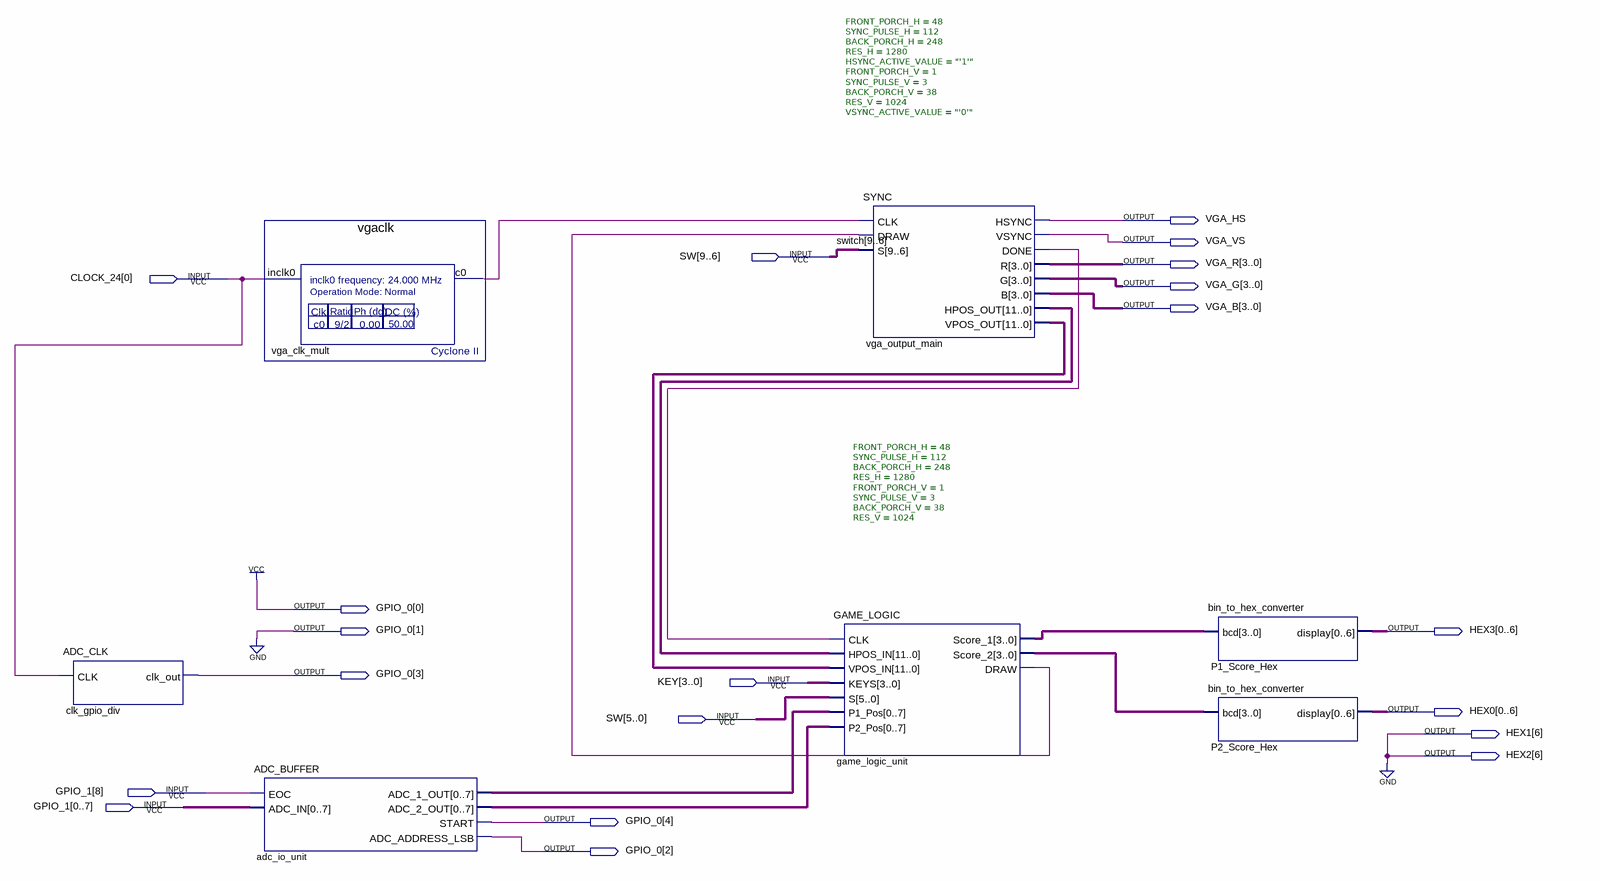
[diagram p0: schematic sheet]
// Quartus schematic VGA_Pong.bdf as structural Verilog: 7 symbols, 20 pins
module VGA_Pong (
  input  [9:0] SW,
  input  [0:0] CLOCK_24,
  input  [3:0] KEY,
  input  [0:8] GPIO_1,
  output VGA_HS,
  output VGA_VS,
  output [3:0] VGA_R,
  output [3:0] VGA_G,
  output [3:0] VGA_B,
  output [4:0] GPIO_0,
  output [0:6] HEX3,
  output [0:6] HEX0,
  output [6:6] HEX1,
  output [6:6] HEX2
);

  wire game_logic_unit_draw, vga_clk_mult_c0, vga_output_main_done;
  wire [3:0] game_logic_unit_score_1, game_logic_unit_score_2;
  wire [7:0] adc_io_unit_adc_1_out, adc_io_unit_adc_2_out;
  wire [11:0] vga_output_main_hpos_out, vga_output_main_vpos_out;

  ADC_CLK clk_gpio_div (.CLK(CLOCK_24[0]), .clk_out(GPIO_0[3]));
  vgaclk vga_clk_mult (.inclk0(CLOCK_24[0]), .c0(vga_clk_mult_c0));
  ADC_BUFFER adc_io_unit (
    .EOC(GPIO_1[8]), .ADC_IN(GPIO_1[0:7]), .ADC_1_OUT(adc_io_unit_adc_1_out),
    .ADC_2_OUT(adc_io_unit_adc_2_out), .START(GPIO_0[4]), .ADC_ADDRESS_LSB(GPIO_0[2]));
  GAME_LOGIC #(.FRONT_PORCH_H(48), .SYNC_PULSE_H(112), .BACK_PORCH_H(248), .RES_H(1280), .FRONT_PORCH_V(1), .SYNC_PULSE_V(3), .BACK_PORCH_V(38), .RES_V(1024)) game_logic_unit (
    .CLK(vga_output_main_done), .HPOS_IN(vga_output_main_hpos_out), .VPOS_IN(vga_output_main_vpos_out),
    .KEYS(KEY), .S(SW[5:0]), .P1_Pos(adc_io_unit_adc_1_out), .P2_Pos(adc_io_unit_adc_2_out),
    .Score_1(game_logic_unit_score_1), .Score_2(game_logic_unit_score_2), .DRAW(game_logic_unit_draw));
  SYNC #(.FRONT_PORCH_H(48), .SYNC_PULSE_H(112), .BACK_PORCH_H(248), .RES_H(1280), .HSYNC_ACTIVE_VALUE("'1'"), .FRONT_PORCH_V(1), .SYNC_PULSE_V(3), .BACK_PORCH_V(38), .RES_V(1024), .VSYNC_ACTIVE_VALUE("'0'")) vga_output_main (
    .CLK(vga_clk_mult_c0), .DRAW(game_logic_unit_draw), .S(SW[9:6]), .HSYNC(VGA_HS), .VSYNC(VGA_VS),
    .DONE(vga_output_main_done), .R(VGA_R), .G(VGA_G), .B(VGA_B), .HPOS_OUT(vga_output_main_hpos_out),
    .VPOS_OUT(vga_output_main_vpos_out));
  bin_to_hex_converter P1_Score_Hex (.bcd(game_logic_unit_score_1), .display(HEX3));
  bin_to_hex_converter P2_Score_Hex (.bcd(game_logic_unit_score_2), .display(HEX0));

  assign GPIO_0[1:0] = 2'b01;
  assign HEX1[6] = 1'b0;
  assign HEX2[6] = 1'b0;

  // Other names for the same wires on the sheet: switch[9:6] = SW[9:6]
endmodule
